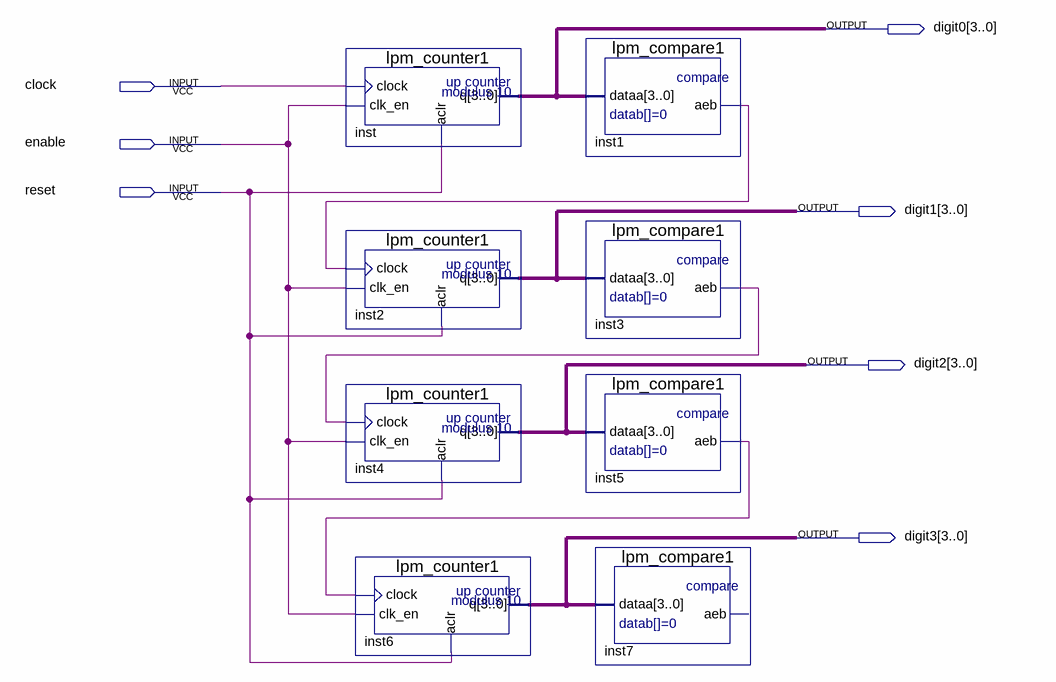
[diagram p0: schematic sheet]
// Quartus schematic BCD_count.bdf as structural Verilog: 8 symbols, 7 pins
module BCD_count (
  input  clock,
  input  enable,
  input  reset,
  output [3:0] digit0,
  output [3:0] digit1,
  output [3:0] digit2,
  output [3:0] digit3
);

  wire inst1_aeb, inst3_aeb, inst5_aeb;

  lpm_counter1 inst (.clock(clock), .clk_en(enable), .aclr(reset), .q(digit0));
  lpm_counter1 inst2 (.clock(inst1_aeb), .clk_en(enable), .aclr(reset), .q(digit1));
  lpm_counter1 inst4 (.clock(inst3_aeb), .clk_en(enable), .aclr(reset), .q(digit2));
  lpm_counter1 inst6 (.clock(inst5_aeb), .clk_en(enable), .aclr(reset), .q(digit3));
  lpm_compare1 inst1 (.dataa(digit0), .aeb(inst1_aeb));
  lpm_compare1 inst3 (.dataa(digit1), .aeb(inst3_aeb));
  lpm_compare1 inst5 (.dataa(digit2), .aeb(inst5_aeb));
  lpm_compare1 inst7 (.dataa(digit3));  // open: aeb
endmodule
